# EAGLE schematic ESP-12E_B_Breakout_SMT (EAGLE 7.4.0)
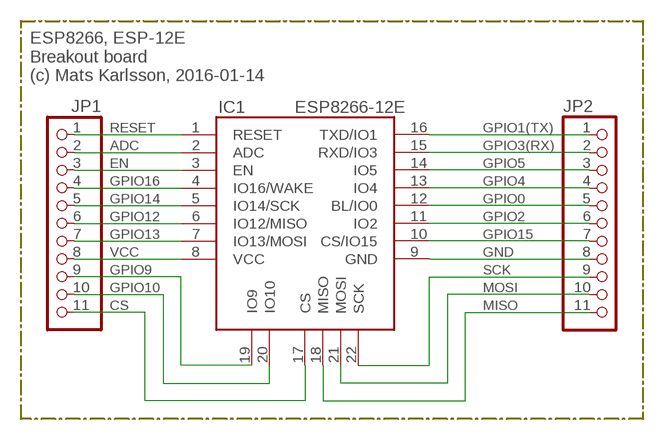
[diagram p0: schematic, sheet 1]

## Parts
IC1  ESP8266-12E  [ESP8266-12E]
JP1  PINHD-1X111X11_SMT  [1X11_SMT]
JP2  PINHD-1X111X11_SMT  [1X11_SMT]

## Nets
ADC: IC1.2(ADC) JP1.2
CS: IC1.17(CS) JP1.11
EN: IC1.3(EN) JP1.3
GND: IC1.9(GND) JP2.8
GPIO0: IC1.12(BL/IO0) JP2.5
GPIO1(TX): IC1.16(TXD/IO1) JP2.1
GPIO2: IC1.11(IO2) JP2.6
GPIO3(RX): IC1.15(RXD/IO3) JP2.2
GPIO4: IC1.13(IO4) JP2.4
GPIO5: IC1.14(IO5) JP2.3
GPIO9: IC1.19(IO9) JP1.9
GPIO10: IC1.20(IO10) JP1.10
GPIO12: IC1.6(IO12/MISO) JP1.6
GPIO13: IC1.7(IO13/MOSI) JP1.7
GPIO14: IC1.5(IO14/SCK) JP1.5
GPIO15: IC1.10(CS/IO15) JP2.7
GPIO16: IC1.4(IO16/WAKE) JP1.4
MISO: IC1.18(MISO) JP2.11
MOSI: IC1.21(MOSI) JP2.10
RESET: IC1.1(RESET) JP1.1
SCK: IC1.22(SCK) JP2.9
VCC: IC1.8(VCC) JP1.8

## Notes on the sheet
- ESP8266, ESP-12E
  Breakout board
  (c) Mats Karlsson, 2016-01-14

## Library data of the parts
IC1 = we-chip:ESP8266-12E: Espressif ESP8266 ESP-12E WiFi/WLAN-Module
JP1 JP2 = pinhead+:PINHD-1X11: PIN HEADER